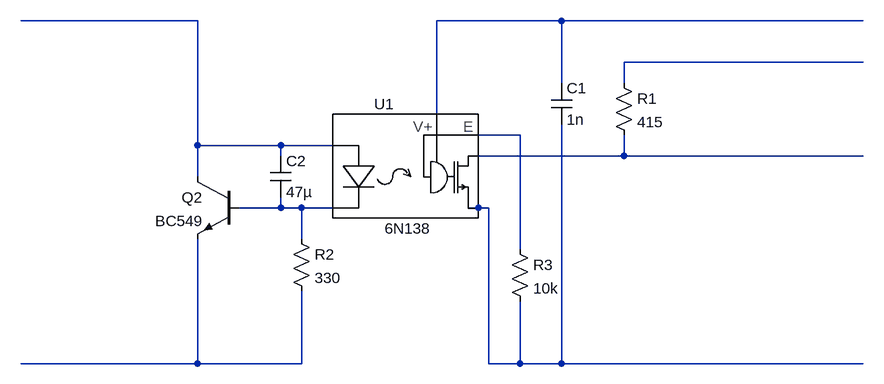
[diagram p0: schematic tty-opto-send.asc]
tty-opto-send.asc, the LTspice schematic file:
Version 4
SHEET 1 1220 680
WIRE -32 96 -304 96
WIRE 528 96 336 96
WIRE 992 96 528 96
WIRE 992 160 624 160
WIRE 528 192 528 96
WIRE 624 192 624 160
WIRE 336 240 336 96
WIRE 464 272 400 272
WIRE -32 288 -32 96
WIRE 96 288 -32 288
WIRE 176 288 96 288
WIRE 96 304 96 288
WIRE 624 304 624 272
WIRE 624 304 400 304
WIRE 992 304 624 304
WIRE -32 336 -32 288
WIRE 96 384 96 368
WIRE 96 384 32 384
WIRE 128 384 96 384
WIRE 176 384 128 384
WIRE 400 384 384 384
WIRE 416 384 400 384
WIRE 128 432 128 384
WIRE 464 448 464 272
WIRE -32 624 -32 432
WIRE -32 624 -304 624
WIRE 128 624 128 512
WIRE 128 624 -32 624
WIRE 416 624 416 384
WIRE 464 624 464 528
WIRE 464 624 416 624
WIRE 528 624 528 256
WIRE 528 624 464 624
WIRE 992 624 528 624
SYMBOL Optos/6N138 272 336 R0
SYMATTR InstName U1
SYMBOL npn 32 336 M0
SYMATTR InstName Q2
SYMATTR Value BC549
SYMBOL res 112 416 R0
SYMATTR InstName R2
SYMATTR Value 330
SYMBOL res 608 176 R0
SYMATTR InstName R1
SYMATTR Value 415
SYMBOL cap 512 192 R0
SYMATTR InstName C1
SYMATTR Value 1n
SYMBOL cap 80 304 R0
SYMATTR InstName C2
SYMATTR Value 47µ
SYMBOL res 448 432 R0
SYMATTR InstName R3
SYMATTR Value 10k

The netlist it stands for:
* tty-opto-send.asc
XU1 N001 N006 N007 N005 N002 N004 6N138  ; pins A K S C V E
Q2 N001 N006 N008 0 BC549
R2 N006 N008 330
R1 N003 N005 415
C1 N002 N007 1n
C2 N001 N006 47µ
R3 N004 N007 10k
.model NPN NPN
.model PNP PNP
.lib standard.bjt
.lib 6N138.SUB
.backanno
.end